# EAGLE design geigera-mullera (EAGLE 7.2.0)
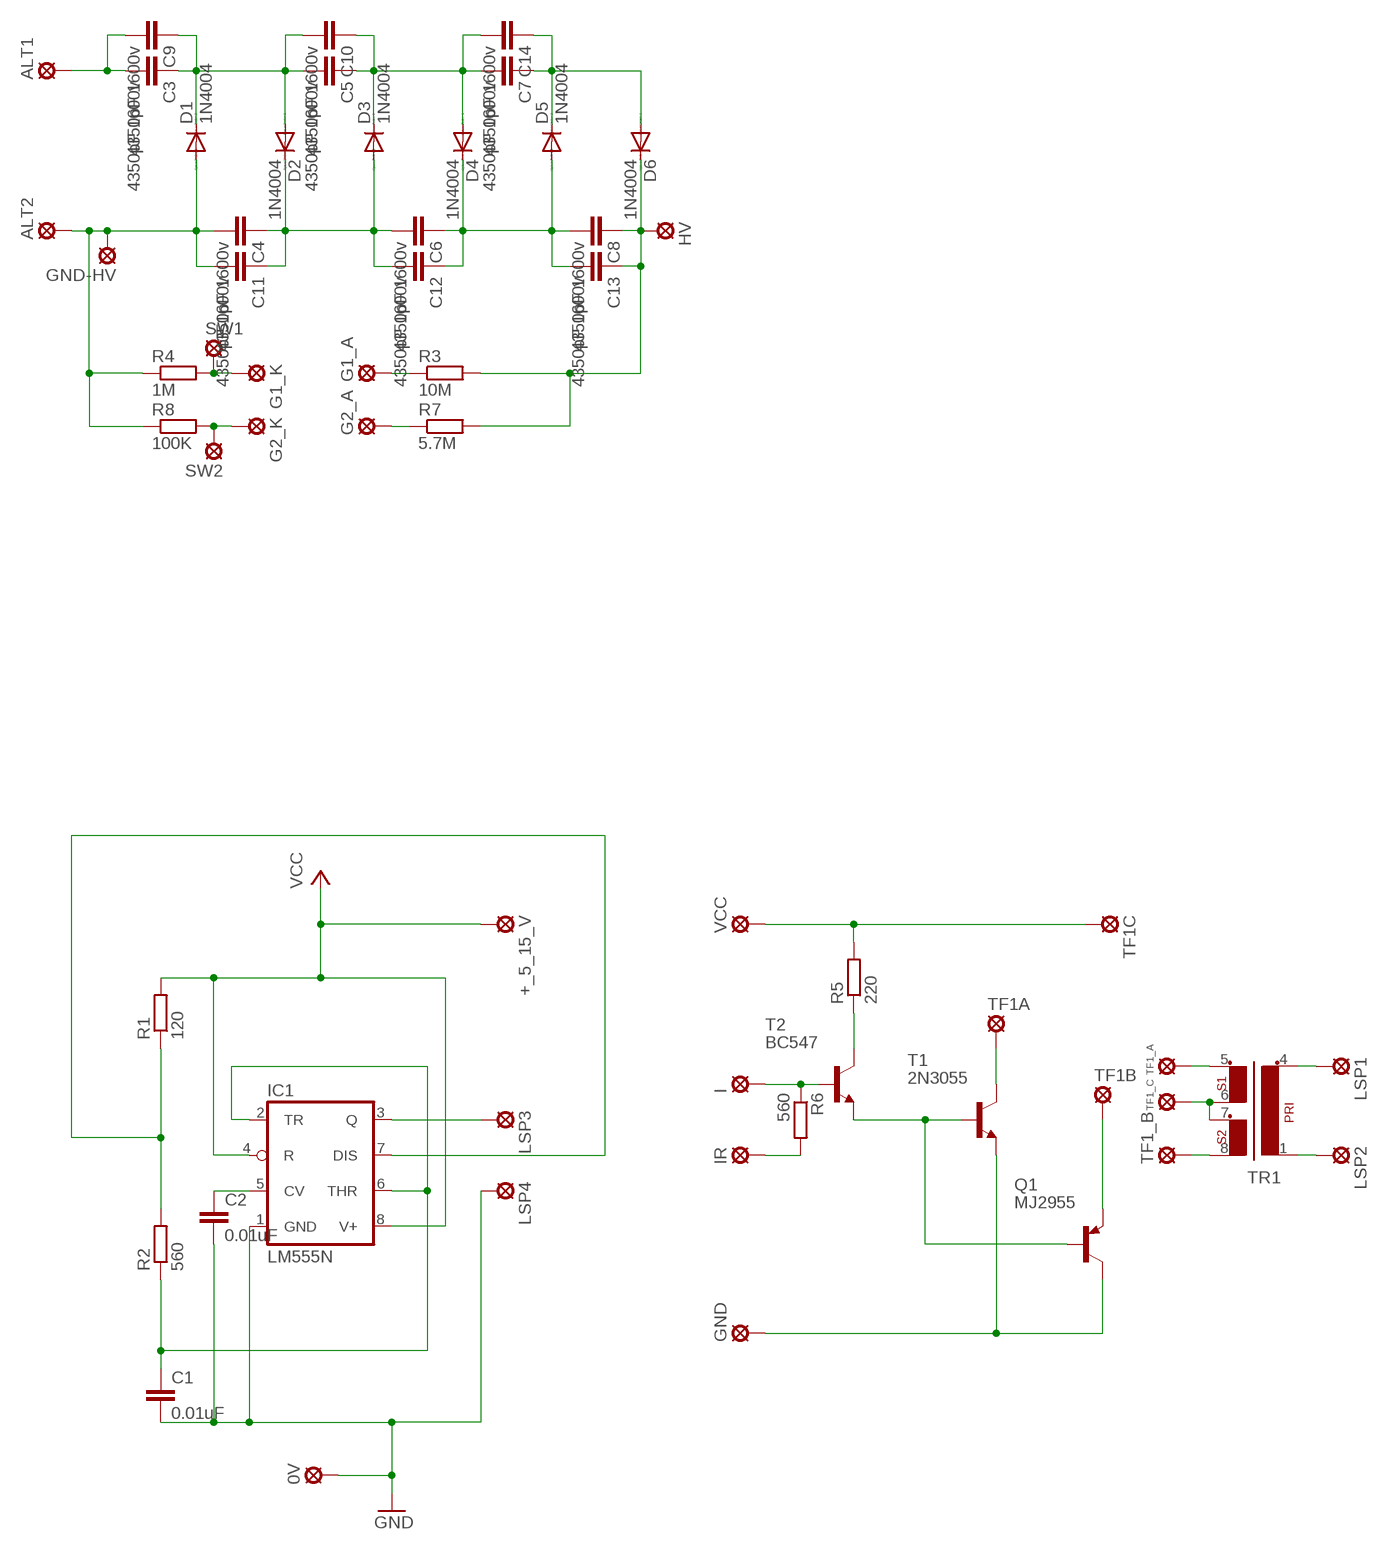
[diagram p0: schematic, sheet 1]

## Parts
0V  LSP10  [LSP10]
+_5_15_V  LSP10  [LSP10]
ALT1  LSP10  [LSP10]
ALT2  LSP10  [LSP10]
C1  0.01uF  C-EU050-024X044  [C050-024X044]
C2  0.01uF  C-EU050-024X044  [C050-024X044]
C3  4350pF 1600v  C-EU225-074X268  [C225-074X268]
C4  4350pF 1600v  C-EU225-074X268  [C225-074X268]
C5  4350pF 1600v  C-EU225-074X268  [C225-074X268]
C6  4350pF 1600v  C-EU225-074X268  [C225-074X268]
C7  4350pF 1600v  C-EU225-074X268  [C225-074X268]
C8  4350pF 1600v  C-EU225-074X268  [C225-074X268]
C9  4350pF 1600v  C-EU225-074X268  [C225-074X268]
C10  4350pF 1600v  C-EU225-074X268  [C225-074X268]
C11  4350pF 1600v  C-EU225-074X268  [C225-074X268]
C12  4350pF 1600v  C-EU225-074X268  [C225-074X268]
C13  4350pF 1600v  C-EU225-074X268  [C225-074X268]
C14  4350pF 1600v  C-EU225-074X268  [C225-074X268]
D1  1N4004  [DO41-10]
D2  1N4004  [DO41-10]
D3  1N4004  [DO41-10]
D4  1N4004  [DO41-10]
D5  1N4004  [DO41-10]
D6  1N4004  [DO41-10]
G1_A  LSP10  [LSP10]
G1_K  LSP10  [LSP10]
G2_A  LSP10  [LSP10]
G2_K  LSP10  [LSP10]
GND  LSP10  [LSP10]
GND-HV  LSP10  [LSP10]
HV  LSP10  [LSP10]
I  LSP10  [LSP10]
IC1  LM555N  [DIL08-ROUND]
IR  LSP10  [LSP10]
LSP1  LSP10  [LSP10]
LSP2  LSP10  [LSP10]
LSP3  LSP10  [LSP10]
LSP4  LSP10  [LSP10]
Q1  MJ2955  [TO3]
R1  120  R-EU_0204/7  [0204/7]
R2  560  R-EU_0204/7  [0204/7]
R3  10M  R-EU_0207/10  [0207/10]
R4  1M  R-EU_0207/10  [0207/10]
R5  220  R-EU_0207/10  [0207/10]
R6  560  R-EU_0207/10  [0207/10]
R7  5.7M  R-EU_0207/10  [0207/10]
R8  100K  R-EU_0207/10  [0207/10]
SW1  LSP10  [LSP10]
SW2  LSP10  [LSP10]
T1  2N3055  [TO3]
T2  BC547  [TO92]
TF1_A  LSP10  [LSP10]
TF1_B  LSP10  [LSP10]
TF1_C  LSP10  [LSP10]
TF1A  LSP10  [LSP10]
TF1B  LSP10  [LSP10]
TF1C  LSP10  [LSP10]
TR1  EE20-2  [EE20-2]
VCC  LSP10  [LSP10]

## Nets
G2_A: G2_A.MP R7.1
GND: 0V.MP C1.2 C2.2 IC1.1(GND) LSP4.MP
N$1: C3.1 C5.2 C9.1 C10.2 D1.C D2.A
N$2: IC1.7(DIS) R1.1 R2.2
N$3: C1.1 IC1.2(TR) IC1.6(THR) R2.1
N$4: TF1_A.MP TR1.5
N$5: R5.2 TF1C.MP VCC.MP
N$6: TF1_C.MP TR1.6 TR1.7
N$7: T1.C T1.C/(C) TF1A.MP
N$8: C2.1 IC1.5(CV)
N$9: Q1.E TF1B.MP
N$10: GND.MP Q1.C Q1.C/(C) T1.E
N$11: Q1.B T1.B T2.1(E)
N$12: LSP1.MP TR1.4
N$13: R5.1 T2.3(C)
N$14: I.MP R6.1 T2.2(B)
N$15: IR.MP R6.2
N$16: LSP2.MP TR1.1
N$17: TF1_B.MP TR1.8
N$18: IC1.3(Q) LSP3.MP
N$19: ALT1.MP C3.2 C9.2
N$21: C4.1 C6.2 C11.1 C12.2 D2.C D3.A
N$22: C5.1 C7.2 C10.1 C14.2 D3.C D4.A
N$23: C6.1 C8.2 C12.1 C13.2 D4.C D5.A
N$24: C7.1 C14.1 D5.C D6.A
N$25: C8.1 C13.1 D6.C HV.MP R3.2 R7.2
N$27: ALT2.MP C4.2 C11.2 D1.A GND-HV.MP R4.1 R8.1
N$28: G1_K.MP R4.2 SW1.MP
N$29: G2_K.MP R8.2 SW2.MP
N$30: G1_A.MP R3.1
VCC: +_5_15_V.MP IC1.4(R) IC1.8(V+) R1.2

## Library data of the parts
0V +_5_15_V ALT1 ALT2 G1_A G1_K G2_A G2_K GND GND-HV HV I IR LSP1-LSP4 SW1 SW2 TF1_A TF1_B TF1_C TF1A TF1B TF1C VCC = solpad:LSP10: SOLDER PAD drill 1.0 mm, distributor Buerklin, 12H555
C1 C2 = resistor:C-EU: CAPACITOR, European symbol
C3-C14 = rcl:C-EU: CAPACITOR, European symbol
D1-D6 = diode:1N4004: DIODE general purpose rectifier, 1 A
IC1 = adafruit:*555: TIMER Changed DIP package to have round (not oval) pin pads http://www.ladyada.net/library/pcb/eaglelibrary.html
Q1 = transistor-pnp:MJ2955: PNP Transistor
R1 R2 = resistor:R-EU_: RESISTOR, European symbol
R3-R8 = rcl:R-EU_: RESISTOR, European symbol
T1 = transistor:2N3055: NPN TRANSISTOR
T2 = transistor:BC547: NPN TRANSISTOR
TR1 = trafo:EE20-2: TRANSFORMER 1 primary winding, 2 secondary windings ERA

## Board
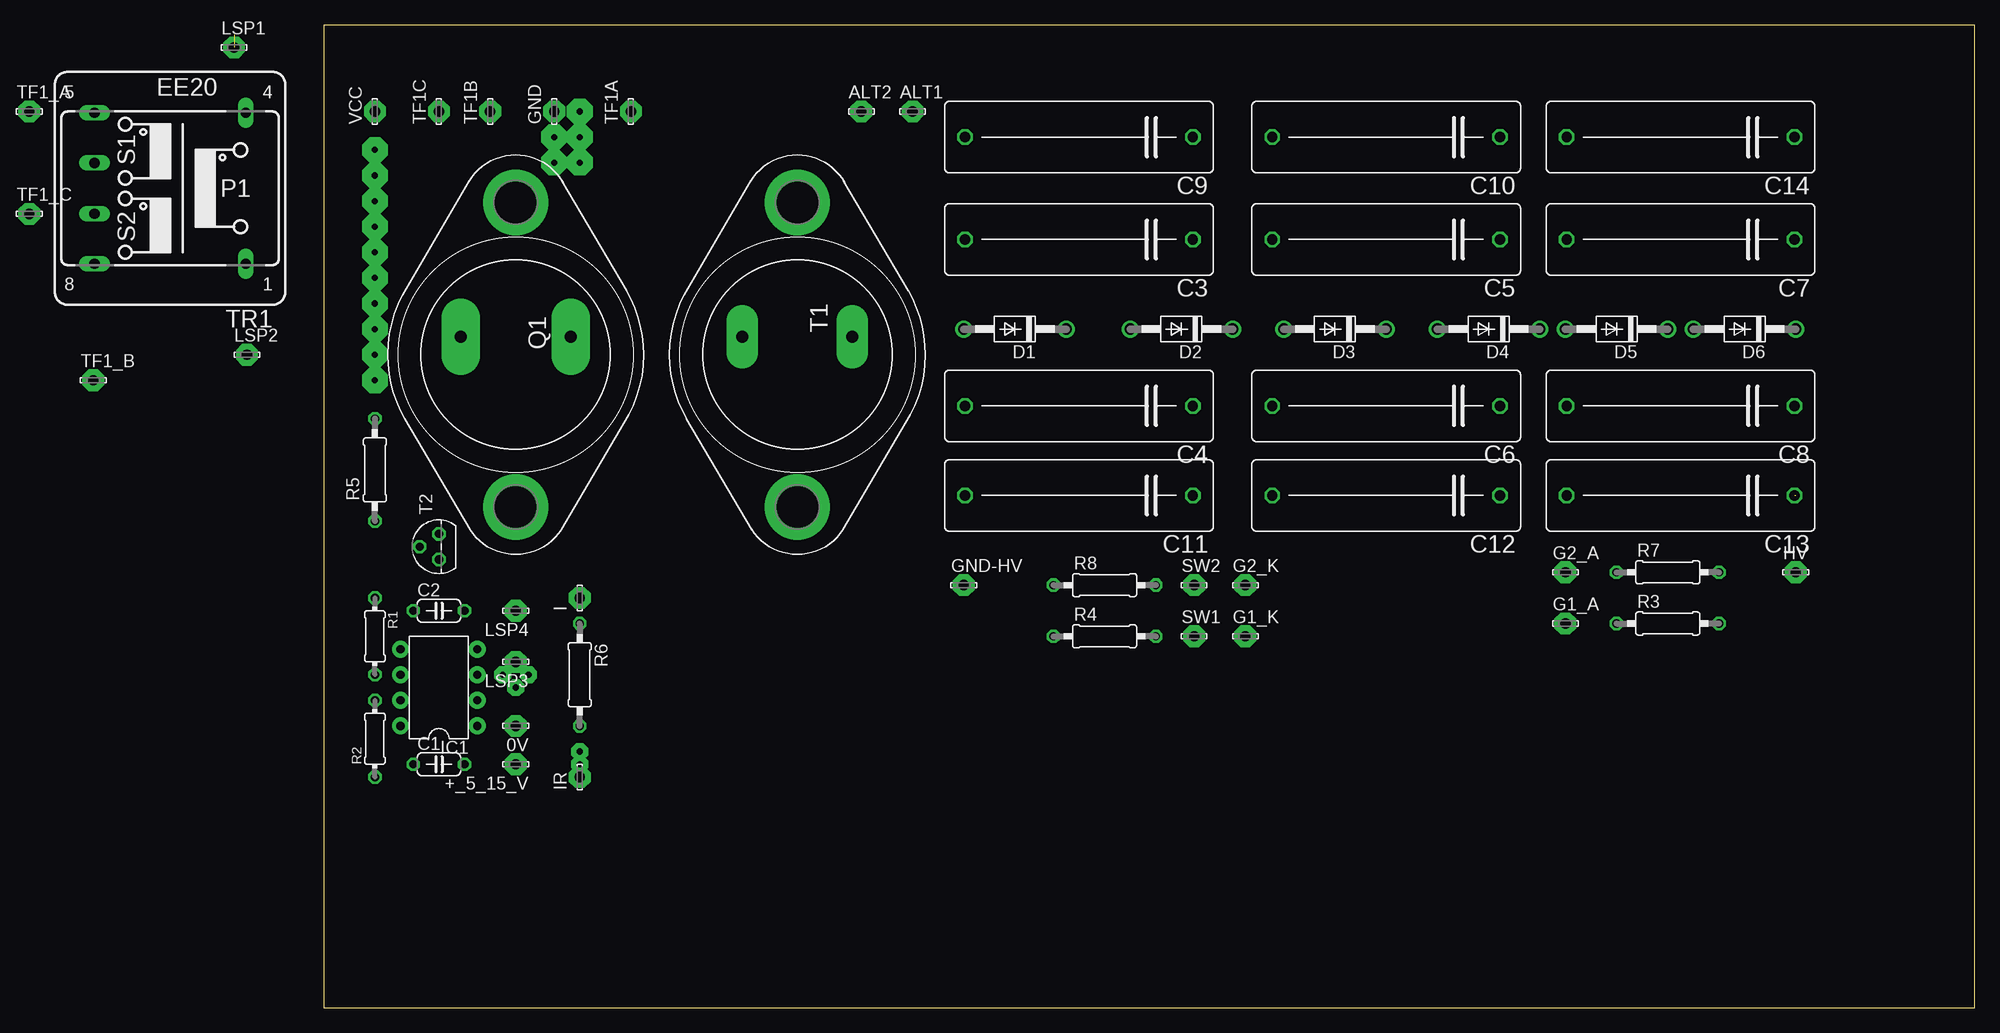
[diagram p1: board, top side]
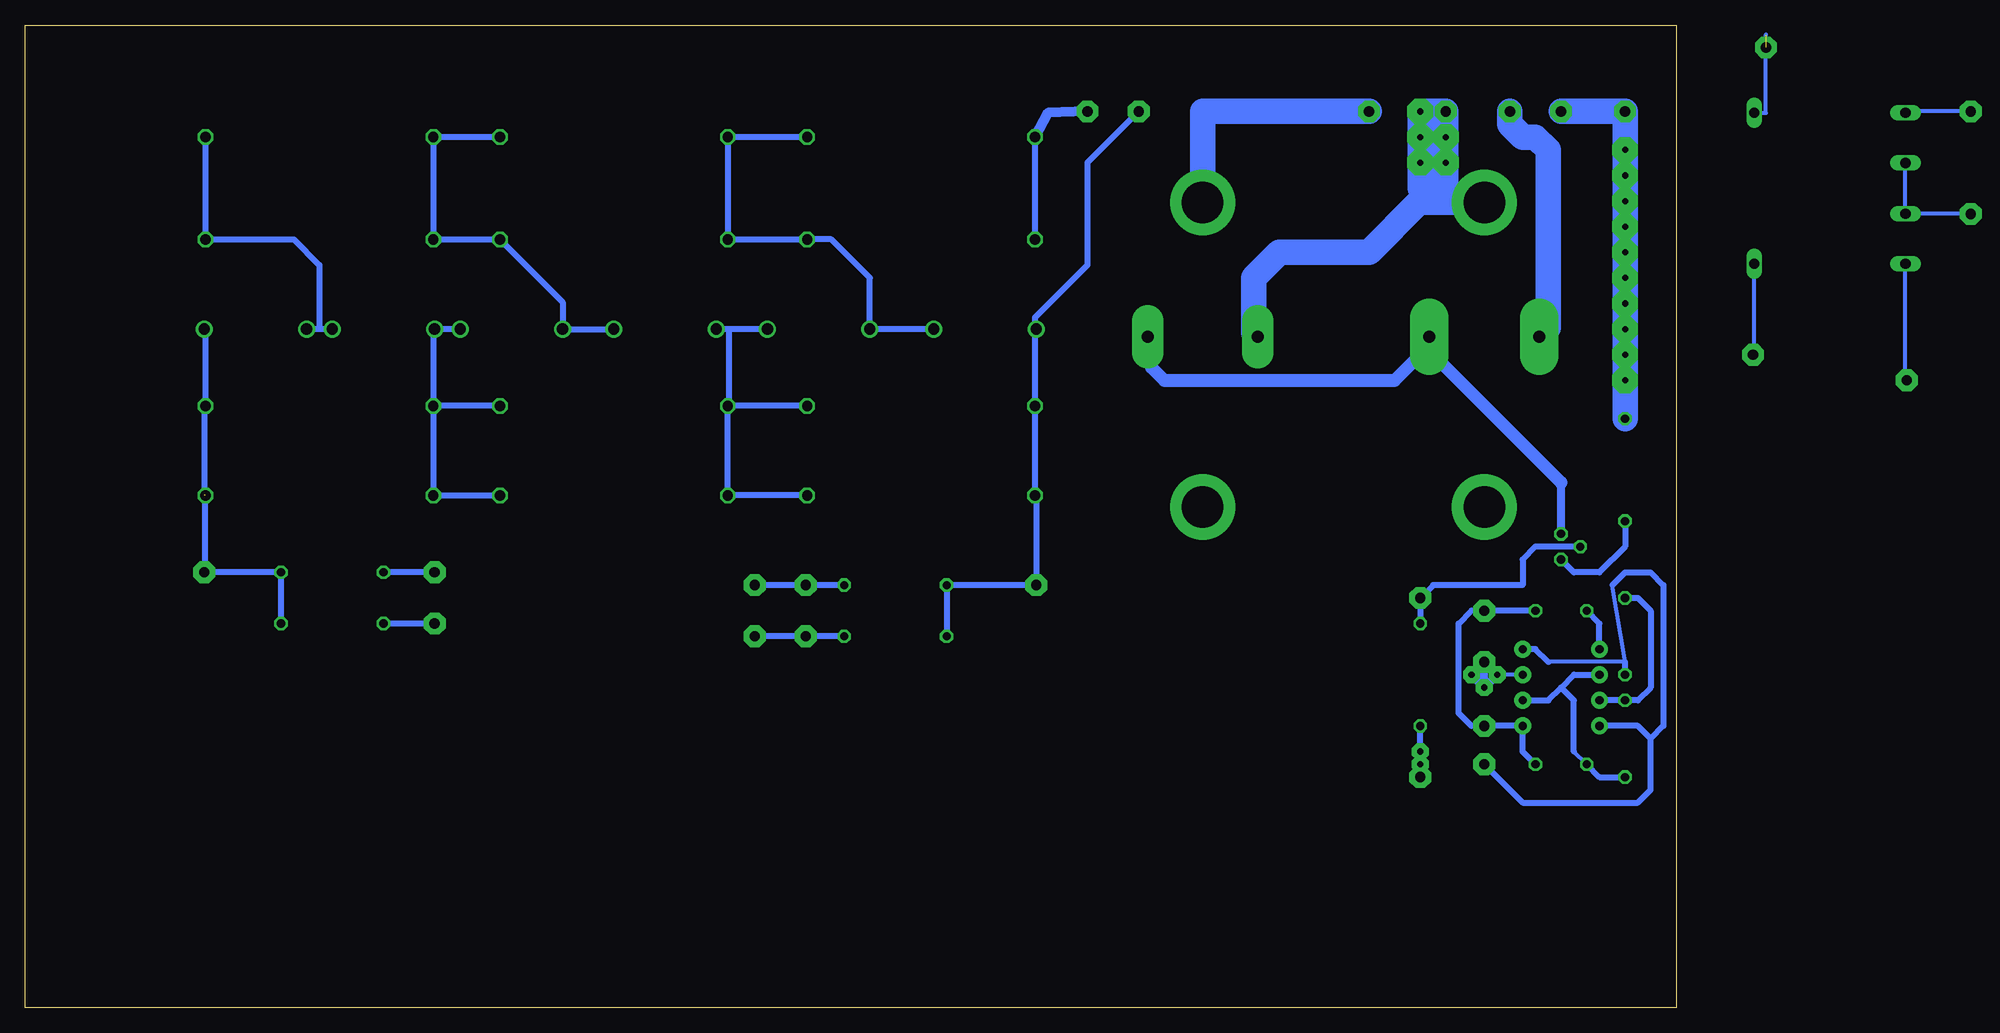
[diagram p2: board, bottom side, seen from below]

Size 163.81 x 97.46 mm. Coordinates in mm from the lower left corner, seen from the top.
Outline: 0,0 163.81,0 163.81,97.46 0,97.46 0,0
Copper layers (1*16): Top 0.035mm / dielectric 1.5mm / Bottom 0.035mm
Design rules "default": minimum track width 10mil, minimum drill 24mil, track to track 8mil, track to pad 8mil, pad to pad 8mil, via to via 8mil, smd to smd 8mil, copper to edge 40mil, drill to drill 8mil, minimum pad ring 10mil, minimum via ring 8mil, stop-mask expansion 4mil, vias tented up to drill 0mil, thermal gap 10mil

### Footprints (pad centres in the part's own frame; a part is rotated, then mirrored left to right if it is on the bottom)
LSP10 = drill 1.016 pad 2.159 octagon: MP 0,0
C050-024X044 = drill 0.813 octagon: 1 -2.54,0; 2 2.54,0
C225-074X268 = drill 1.016 octagon: 1 -11.303,0; 2 11.303,0
DO41-10 = drill 1.118: A 5.08,0; C -5.08,0
DIL08-ROUND = drill 0.813 pad 1.676: 1 -3.81,-3.81; 2 -1.27,-3.81; 3 1.27,-3.81; 4 3.81,-3.81; 5 3.81,3.81; 6 1.27,3.81; 7 -1.27,3.81; 8 -3.81,3.81
TO3 = drill 1.194 pad 3.81 long: B -1.778,5.461; E -1.778,-5.461 | drill 4.115 pad 6.477: C 15.113,0; C/ -15.113,0
0204/7 = drill 0.813 octagon: 1 -3.81,0; 2 3.81,0
0207/10 = drill 0.813 octagon: 1 -5.08,0; 2 5.08,0
TO3' = drill 1.194 pad 3.15 long: B -1.778,5.461; E -1.778,-5.461 | drill 4.115 pad 6.477: C 15.113,0; C/ -15.113,0
TO92 = drill 0.813 octagon: 1 1.27,0; 2 0,1.905; 3 -1.27,0
EE20-2 = drill 1.016 long: 1 -7.493,7.493; 4 -7.493,-7.493; 5 7.493,-7.493; 6 7.493,-2.515; 7 7.493,2.515; 8 7.493,7.493

### Placement (x,y rotation side)
0V  19.05,27.94 180 top
+_5_15_V  19.05,24.13 180 top
ALT1  58.42,88.9 0 top
ALT2  53.34,88.9 0 top
C1  11.43,24.13 0 top
C2  11.43,39.37 0 top
C3  74.93,76.2 180 top
C4  74.93,59.69 180 top
C5  105.41,76.2 180 top
C6  105.41,59.69 180 top
C7  134.62,76.2 180 top
C8  134.62,59.69 180 top
C9  74.93,86.36 180 top
C10  105.41,86.36 180 top
C11  74.93,50.8 180 top
C12  105.41,50.8 180 top
C13  134.62,50.8 180 top
C14  134.62,86.36 180 top
D1  68.58,67.31 180 top
D2  85.09,67.31 180 top
D3  100.33,67.31 180 top
D4  115.57,67.31 180 top
D5  128.27,67.31 180 top
D6  140.97,67.31 180 top
G1_A  123.19,38.1 0 top
G1_K  91.44,36.83 0 top
G2_A  123.19,43.18 0 top
G2_K  91.44,41.91 0 top
GND  22.86,88.9 90 top
GND-HV  63.5,41.91 0 top
HV  146.05,43.18 0 top
I  25.4,40.64 90 top
IC1  11.43,31.75 90 top
IR  25.4,22.86 90 top
LSP1  -8.89,95.25 0 top  (outside the outline)
LSP2  -7.62,64.77 0 top  (outside the outline)
LSP3  19.05,34.29 180 top
LSP4  19.05,39.37 180 top
Q1  19.05,64.77 270 top
R1  5.08,36.83 270 top
R2  5.08,26.67 90 top
R3  133.35,38.1 0 top
R4  77.47,36.83 0 top
R5  5.08,53.34 90 top
R6  25.4,33.02 270 top
R7  133.35,43.18 0 top
R8  77.47,41.91 0 top
SW1  86.36,36.83 0 top
SW2  86.36,41.91 0 top
T1  2N3055  [TO3']  46.99,64.77 270 top
T2  11.43,45.72 90 top
TF1_A  -29.21,88.9 0 top  (outside the outline)
TF1_B  -22.86,62.23 0 top  (outside the outline)
TF1_C  -29.21,78.74 0 top  (outside the outline)
TF1A  30.48,88.9 90 top
TF1B  16.51,88.9 90 top
TF1C  11.43,88.9 90 top
TR1  -15.24,81.28 180 top  (outside the outline)
VCC  5.08,88.9 90 top

### Tracks (layer width: path | path; a pad name or v marks a point on that pad's centre or on a via)
G2_A
  Bottom 0.61: G2_A.MP R7.1
GND
  Bottom 0.406: 0V.MP 20.32,27.94 | 20.32,39.37 LSP4.MP
  Bottom 0.61: C1.2 15.24,25.4 IC1.1 0V.MP | C2.2 LSP4.MP | 20.32,27.94 21.59,29.21 21.59,38.1 20.32,39.37
N$1
  Bottom 0.61: C9.1 C10.2 C5.2 C3.1 83.82,76.2 80.01,72.39 D2.A D1.C
N$2
  Bottom 0.61: IC1.7 R2.2 3.81,30.48 2.54,31.75 2.54,39.37 3.81,40.64 R1.1
N$3
  Bottom 0.406: C1.1 10.16,25.4
  Bottom 0.61: C1.1 7.62,22.86 R2.1 | IC1.2 12.7,30.48 11.43,31.75 | 11.43,31.75 10.16,33.02 IC1.6 | 10.16,25.4 10.16,30.48 11.43,31.75
N$4
  Bottom 0.406: TF1_A.MP -22.73,88.9 TR1.5
N$5  (via drill 0.6 pad 2.54)
  Bottom 2.54: R5.2 v5.08,62.23 v5.08,64.77 v5.08,67.31 v5.08,69.85 v5.08,72.39 v5.08,74.93 v5.08,77.47 v5.08,80.01 v5.08,82.55 v5.08,85.09 VCC.MP TF1C.MP
N$6
  Bottom 0.406: TF1_C.MP -22.73,78.74 TR1.7 TR1.6
N$7
  Bottom 2.54: TF1A.MP 46.99,88.9 T1.C/
N$8
  Bottom 0.61: IC1.5 7.62,38.1 C2.1
N$9
  Bottom 2.54: Q1.E 12.7,67.44 12.7,85.09 13.97,86.36 15.24,86.36 16.51,87.63 TF1B.MP
N$10  (via drill 0.6 pad 2.54)
  Bottom 2.54: T1.E 41.91,66.93 41.91,72.39 39.37,74.93 30.48,74.93 25.53,79.88 Q1.C/ 22.73,79.88 22.86,80.01 v22.86,83.82 v22.86,86.36 GND.MP v25.4,88.9 v25.4,86.36 v25.4,83.82 25.4,81.28
N$11
  Bottom 0.813: T2.1 11.43,52.07
  Bottom 1.27: 24.76,65.41 27.94,62.23 50.8,62.23 52.07,63.5 52.07,66.17 T1.B | 24.76,65.41 24.13,66.04 24.13,67.31 24.51,66.93 Q1.B | 11.43,52.07 24.76,65.41
  Bottom 2.54: 24.51,65.66 Q1.B
N$12  (1 unrouted)
  Bottom 0.406: TR1.4 -8.89,88.77 -8.89,96.52
N$13
  Bottom 0.61: R5.1 5.08,45.72 7.62,43.18 10.16,43.18 T2.3
N$14
  Bottom 0.61: R6.1 I.MP 24.13,41.91 15.24,41.91 15.24,44.45 13.97,45.72 T2.2
N$15  (via drill 0.6 pad 1.68)
  Bottom 0.61: IR.MP v25.4,24.13 v25.4,25.4 R6.2
N$16
  Bottom 0.406: LSP2.MP -7.75,64.77 TR1.1
N$17
  Bottom 0.406: TF1_B.MP -22.73,62.23 TR1.8
N$18  (via drill 0.6 pad 1.68)
  Bottom 0.406: IC1.3 v17.78,33.02
  Bottom 0.813: v19.05,31.75 v17.78,33.02 LSP3.MP | v19.05,31.75 v20.32,33.02 LSP3.MP | v19.05,31.75 LSP3.MP
N$19
  Bottom 0.61: C9.2 C3.2
  Bottom 1.016: ALT1.MP 62.36,88.77 C9.2
N$21
  Bottom 0.61: D2.C 93.98,67.31 | 93.98,67.31 D3.A | C11.1 C12.2 C6.2 | C4.1 C6.2 | C6.2 93.98,59.82 93.98,67.31
N$22
  Bottom 0.61: C10.1 C14.2 C7.2 C5.1 110.49,69.98 D4.A D3.C
N$23
  Bottom 0.61: C6.1 C8.2 | C8.2 123.32,58.42 C13.2 C12.1 | D4.C D5.A 123.32,67.18 C8.2
N$24
  Bottom 0.61: D5.C 134.62,67.31 | 134.62,67.31 D6.A | C14.1 C7.1 137.16,76.2 134.62,73.66 134.62,67.31
N$25  (1 unrouted)
  Bottom 0.61: D6.C 145.92,67.18 C8.1 146.05,59.56 146.05,50.8 | R3.2 R7.2 HV.MP 145.92,43.31 C13.1
N$27
  Bottom 0.61: D1.A 63.63,67.18 | 63.63,67.18 C4.2 C11.2 63.5,50.67 GND-HV.MP R8.1 R4.1 | ALT2.MP 58.42,83.82 58.42,73.66 63.63,68.45 63.63,67.18
N$28
  Bottom 0.61: R4.2 SW1.MP G1_K.MP
N$29
  Bottom 0.61: R8.2 SW2.MP G2_K.MP
N$30
  Bottom 0.61: G1_A.MP R3.1
VCC
  Bottom 0.406: 12.7,34.29 5.08,34.29 6.35,41.91
  Bottom 0.61: +_5_15_V.MP 15.24,20.32 3.81,20.32 2.54,21.59 2.54,26.67 | 2.54,26.67 3.81,27.94 IC1.8 | 12.7,34.29 13.97,35.56 IC1.4 | R1.2 5.08,34.29 | 6.35,41.91 5.08,43.18 2.54,43.18 1.27,41.91 1.27,27.94 2.54,26.67